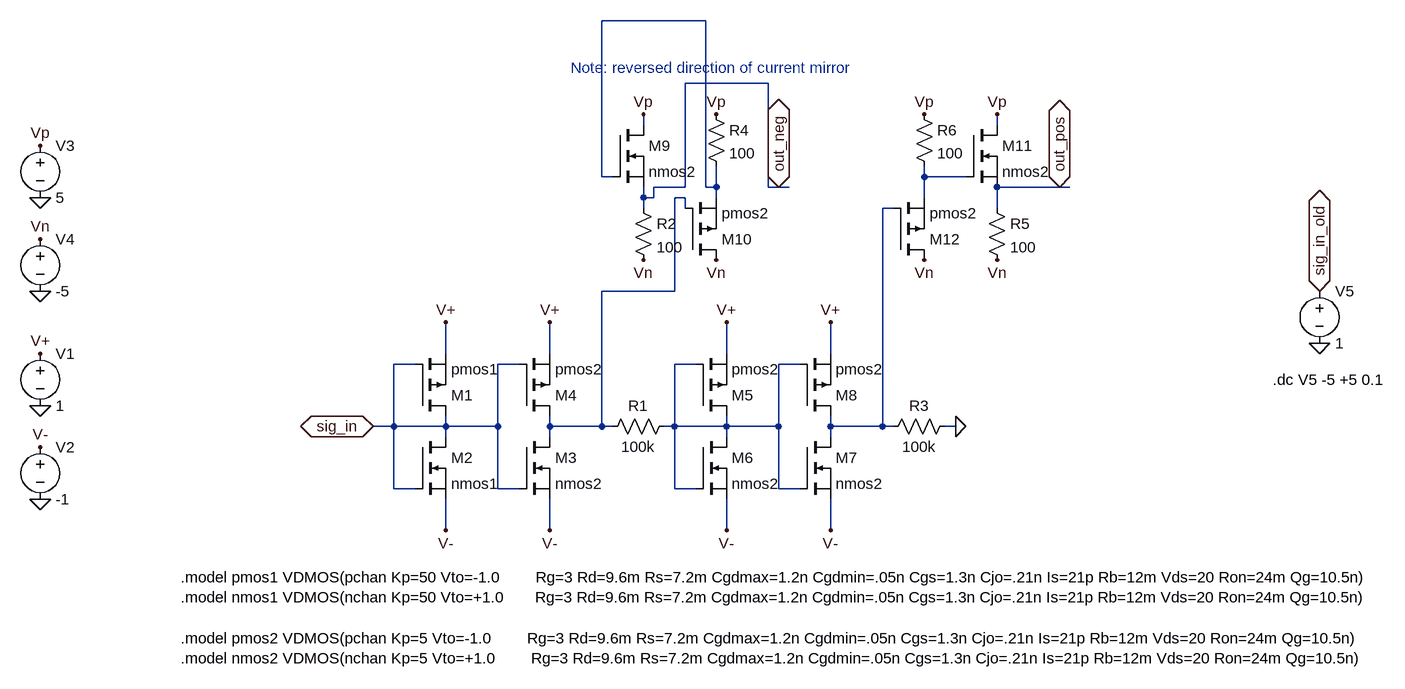
[diagram p0: schematic neuron_tanh_template_unmatched.asc]
neuron_tanh_template_unmatched.asc, the LTspice schematic file:
Version 4
SHEET 1 2176 680
WIRE 784 -544 624 -544
WIRE 880 -448 752 -448
WIRE 688 -384 688 -400
WIRE 1232 -384 1232 -400
WIRE 624 -304 624 -544
WIRE 640 -304 624 -304
WIRE 1120 -304 1120 -320
WIRE 1184 -304 1120 -304
WIRE 752 -288 752 -448
WIRE 752 -288 704 -288
WIRE 784 -288 784 -544
WIRE 800 -288 800 -320
WIRE 800 -288 784 -288
WIRE 880 -288 880 -448
WIRE 896 -288 880 -288
WIRE 912 -288 896 -288
WIRE 1328 -288 1232 -288
WIRE 1344 -288 1328 -288
WIRE 688 -272 688 -288
WIRE 704 -272 704 -288
WIRE 704 -272 688 -272
WIRE 752 -272 736 -272
WIRE 800 -272 800 -288
WIRE 1120 -272 1120 -304
WIRE 688 -256 688 -272
WIRE 752 -256 752 -272
WIRE 1072 -256 1056 -256
WIRE 1232 -256 1232 -288
WIRE 736 -128 736 -272
WIRE 736 -128 624 -128
WIRE 384 -32 384 -80
WIRE 544 -32 544 -80
WIRE 816 -32 816 -80
WIRE 976 -32 976 -80
WIRE 336 -16 304 -16
WIRE 496 -16 464 -16
WIRE 768 -16 736 -16
WIRE 928 -16 896 -16
WIRE 304 80 304 -16
WIRE 304 80 272 80
WIRE 384 80 384 64
WIRE 384 80 304 80
WIRE 464 80 464 -16
WIRE 464 80 384 80
WIRE 544 80 544 64
WIRE 624 80 624 -128
WIRE 624 80 544 80
WIRE 640 80 624 80
WIRE 736 80 736 -16
WIRE 736 80 720 80
WIRE 816 80 816 64
WIRE 816 80 736 80
WIRE 896 80 896 -16
WIRE 896 80 816 80
WIRE 976 80 976 64
WIRE 1056 80 1056 -256
WIRE 1056 80 976 80
WIRE 1072 80 1056 80
WIRE 1168 80 1152 80
WIRE 384 96 384 80
WIRE 544 96 544 80
WIRE 816 96 816 80
WIRE 976 96 976 80
WIRE 304 176 304 80
WIRE 336 176 304 176
WIRE 464 176 464 80
WIRE 496 176 464 176
WIRE 736 176 736 80
WIRE 768 176 736 176
WIRE 896 176 896 80
WIRE 928 176 896 176
WIRE 384 240 384 192
WIRE 544 240 544 192
WIRE 816 240 816 192
WIRE 976 240 976 192
FLAG -240 48 0
FLAG -240 -32 V+
FLAG -240 192 0
FLAG -240 112 V-
FLAG 384 -80 V+
FLAG 384 240 V-
FLAG 544 -80 V+
FLAG 544 240 V-
FLAG 1328 -288 out_pos
IOPIN 1328 -288 BiDir
FLAG 816 -80 V+
FLAG 816 240 V-
FLAG 976 -80 V+
FLAG 976 240 V-
FLAG 896 -288 out_neg
IOPIN 896 -288 BiDir
FLAG 1168 80 0
FLAG 272 80 sig_in
IOPIN 272 80 BiDir
FLAG -240 -272 0
FLAG -240 -352 Vp
FLAG -240 -128 0
FLAG -240 -208 Vn
FLAG 688 -400 Vp
FLAG 800 -400 Vp
FLAG 800 -176 Vn
FLAG 688 -176 Vn
FLAG 1232 -400 Vp
FLAG 1120 -400 Vp
FLAG 1120 -176 Vn
FLAG 1232 -176 Vn
FLAG 1728 -48 0
FLAG 1728 -128 sig_in_old
IOPIN 1728 -128 BiDir
SYMBOL pmos 336 64 M180
SYMATTR InstName M1
SYMATTR Value pmos1
SYMBOL voltage -240 -48 R0
WINDOW 123 0 0 Left 0
WINDOW 39 0 0 Left 0
SYMATTR InstName V1
SYMATTR Value 1
SYMBOL voltage -240 96 R0
WINDOW 123 0 0 Left 0
WINDOW 39 0 0 Left 0
SYMATTR InstName V2
SYMATTR Value -1
SYMBOL nmos 336 96 R0
SYMATTR InstName M2
SYMATTR Value nmos1
SYMBOL nmos 496 96 R0
SYMATTR InstName M3
SYMATTR Value nmos2
SYMBOL pmos 496 64 M180
SYMATTR InstName M4
SYMATTR Value pmos2
SYMBOL res 624 96 R270
WINDOW 0 32 56 VTop 2
WINDOW 3 0 56 VBottom 2
SYMATTR InstName R1
SYMATTR Value 100k
SYMBOL pmos 768 64 M180
SYMATTR InstName M5
SYMATTR Value pmos2
SYMBOL nmos 768 96 R0
SYMATTR InstName M6
SYMATTR Value nmos2
SYMBOL nmos 928 96 R0
SYMATTR InstName M7
SYMATTR Value nmos2
SYMBOL pmos 928 64 M180
SYMATTR InstName M8
SYMATTR Value pmos2
SYMBOL res 1056 96 R270
WINDOW 0 32 56 VTop 2
WINDOW 3 0 56 VBottom 2
SYMATTR InstName R3
SYMATTR Value 100k
SYMBOL nmos 640 -384 R0
SYMATTR InstName M9
SYMATTR Value nmos2
SYMBOL voltage -240 -368 R0
WINDOW 123 0 0 Left 0
WINDOW 39 0 0 Left 0
SYMATTR InstName V3
SYMATTR Value 5
SYMBOL voltage -240 -224 R0
WINDOW 123 0 0 Left 0
WINDOW 39 0 0 Left 0
SYMATTR InstName V4
SYMATTR Value -5
SYMBOL res 672 -272 R0
SYMATTR InstName R2
SYMATTR Value 100
SYMBOL pmos 752 -176 M180
SYMATTR InstName M10
SYMATTR Value pmos2
SYMBOL res 784 -416 R0
SYMATTR InstName R4
SYMATTR Value 100
SYMBOL nmos 1184 -384 R0
SYMATTR InstName M11
SYMATTR Value nmos2
SYMBOL res 1216 -272 R0
SYMATTR InstName R5
SYMATTR Value 100
SYMBOL pmos 1072 -176 M180
SYMATTR InstName M12
SYMATTR Value pmos2
SYMBOL res 1104 -416 R0
SYMATTR InstName R6
SYMATTR Value 100
SYMBOL voltage 1728 -144 R0
WINDOW 123 0 0 Left 0
WINDOW 39 0 0 Left 0
SYMATTR InstName V5
SYMATTR Value 1
TEXT -24 312 Left 2 !.model pmos1 VDMOS(pchan Kp=50 Vto=-1.0        Rg=3 Rd=9.6m Rs=7.2m Cgdmax=1.2n Cgdmin=.05n Cgs=1.3n Cjo=.21n Is=21p Rb=12m Vds=20 Ron=24m Qg=10.5n)\n.model nmos1 VDMOS(nchan Kp=50 Vto=+1.0       Rg=3 Rd=9.6m Rs=7.2m Cgdmax=1.2n Cgdmin=.05n Cgs=1.3n Cjo=.21n Is=21p Rb=12m Vds=20 Ron=24m Qg=10.5n)\n \n.model pmos2 VDMOS(pchan Kp=5 Vto=-1.0        Rg=3 Rd=9.6m Rs=7.2m Cgdmax=1.2n Cgdmin=.05n Cgs=1.3n Cjo=.21n Is=21p Rb=12m Vds=20 Ron=24m Qg=10.5n)\n.model nmos2 VDMOS(nchan Kp=5 Vto=+1.0        Rg=3 Rd=9.6m Rs=7.2m Cgdmax=1.2n Cgdmin=.05n Cgs=1.3n Cjo=.21n Is=21p Rb=12m Vds=20 Ron=24m Qg=10.5n)
TEXT 576 -472 Left 2 ;Note: reversed direction of current mirror
TEXT 1656 8 Left 2 !.dc V5 -5 +5 0.1

The netlist it stands for:
* neuron_tanh_template_unmatched.asc
M1 sig_in sig_in V+ V+ pmos1
V1 V+ 0 1
V2 V- 0 -1
M2 sig_in sig_in V- V- nmos1
M3 N003 sig_in V- V- nmos2
M4 N003 sig_in V+ V+ pmos2
R1 N003 N005 100k
M5 N005 N005 V+ V+ pmos2
M6 N005 N005 V- V- nmos2
M7 N004 N005 V- V- nmos2
M8 N004 N005 V+ V+ pmos2
R3 N004 0 100k
M9 Vp N001 out_neg out_neg nmos2
V3 Vp 0 5
V4 Vn 0 -5
R2 out_neg Vn 100
M10 Vn N003 N001 N001 pmos2
R4 Vp N001 100
M11 Vp N002 out_pos out_pos nmos2
R5 out_pos Vn 100
M12 Vn N004 N002 N002 pmos2
R6 Vp N002 100
V5 sig_in_old 0 1
.model NMOS NMOS
.model PMOS PMOS
.lib standard.mos
.model pmos1 VDMOS(pchan Kp=50 Vto=-1.0        Rg=3 Rd=9.6m Rs=7.2m Cgdmax=1.2n Cgdmin=.05n Cgs=1.3n Cjo=.21n Is=21p Rb=12m Vds=20 Ron=24m Qg=10.5n)
.model nmos1 VDMOS(nchan Kp=50 Vto=+1.0       Rg=3 Rd=9.6m Rs=7.2m Cgdmax=1.2n Cgdmin=.05n Cgs=1.3n Cjo=.21n Is=21p Rb=12m Vds=20 Ron=24m Qg=10.5n)
.model pmos2 VDMOS(pchan Kp=5 Vto=-1.0        Rg=3 Rd=9.6m Rs=7.2m Cgdmax=1.2n Cgdmin=.05n Cgs=1.3n Cjo=.21n Is=21p Rb=12m Vds=20 Ron=24m Qg=10.5n)
.model nmos2 VDMOS(nchan Kp=5 Vto=+1.0        Rg=3 Rd=9.6m Rs=7.2m Cgdmax=1.2n Cgdmin=.05n Cgs=1.3n Cjo=.21n Is=21p Rb=12m Vds=20 Ron=24m Qg=10.5n)
* Note: reversed direction of current mirror
.dc V5 -5 +5 0.1
.backanno
.end